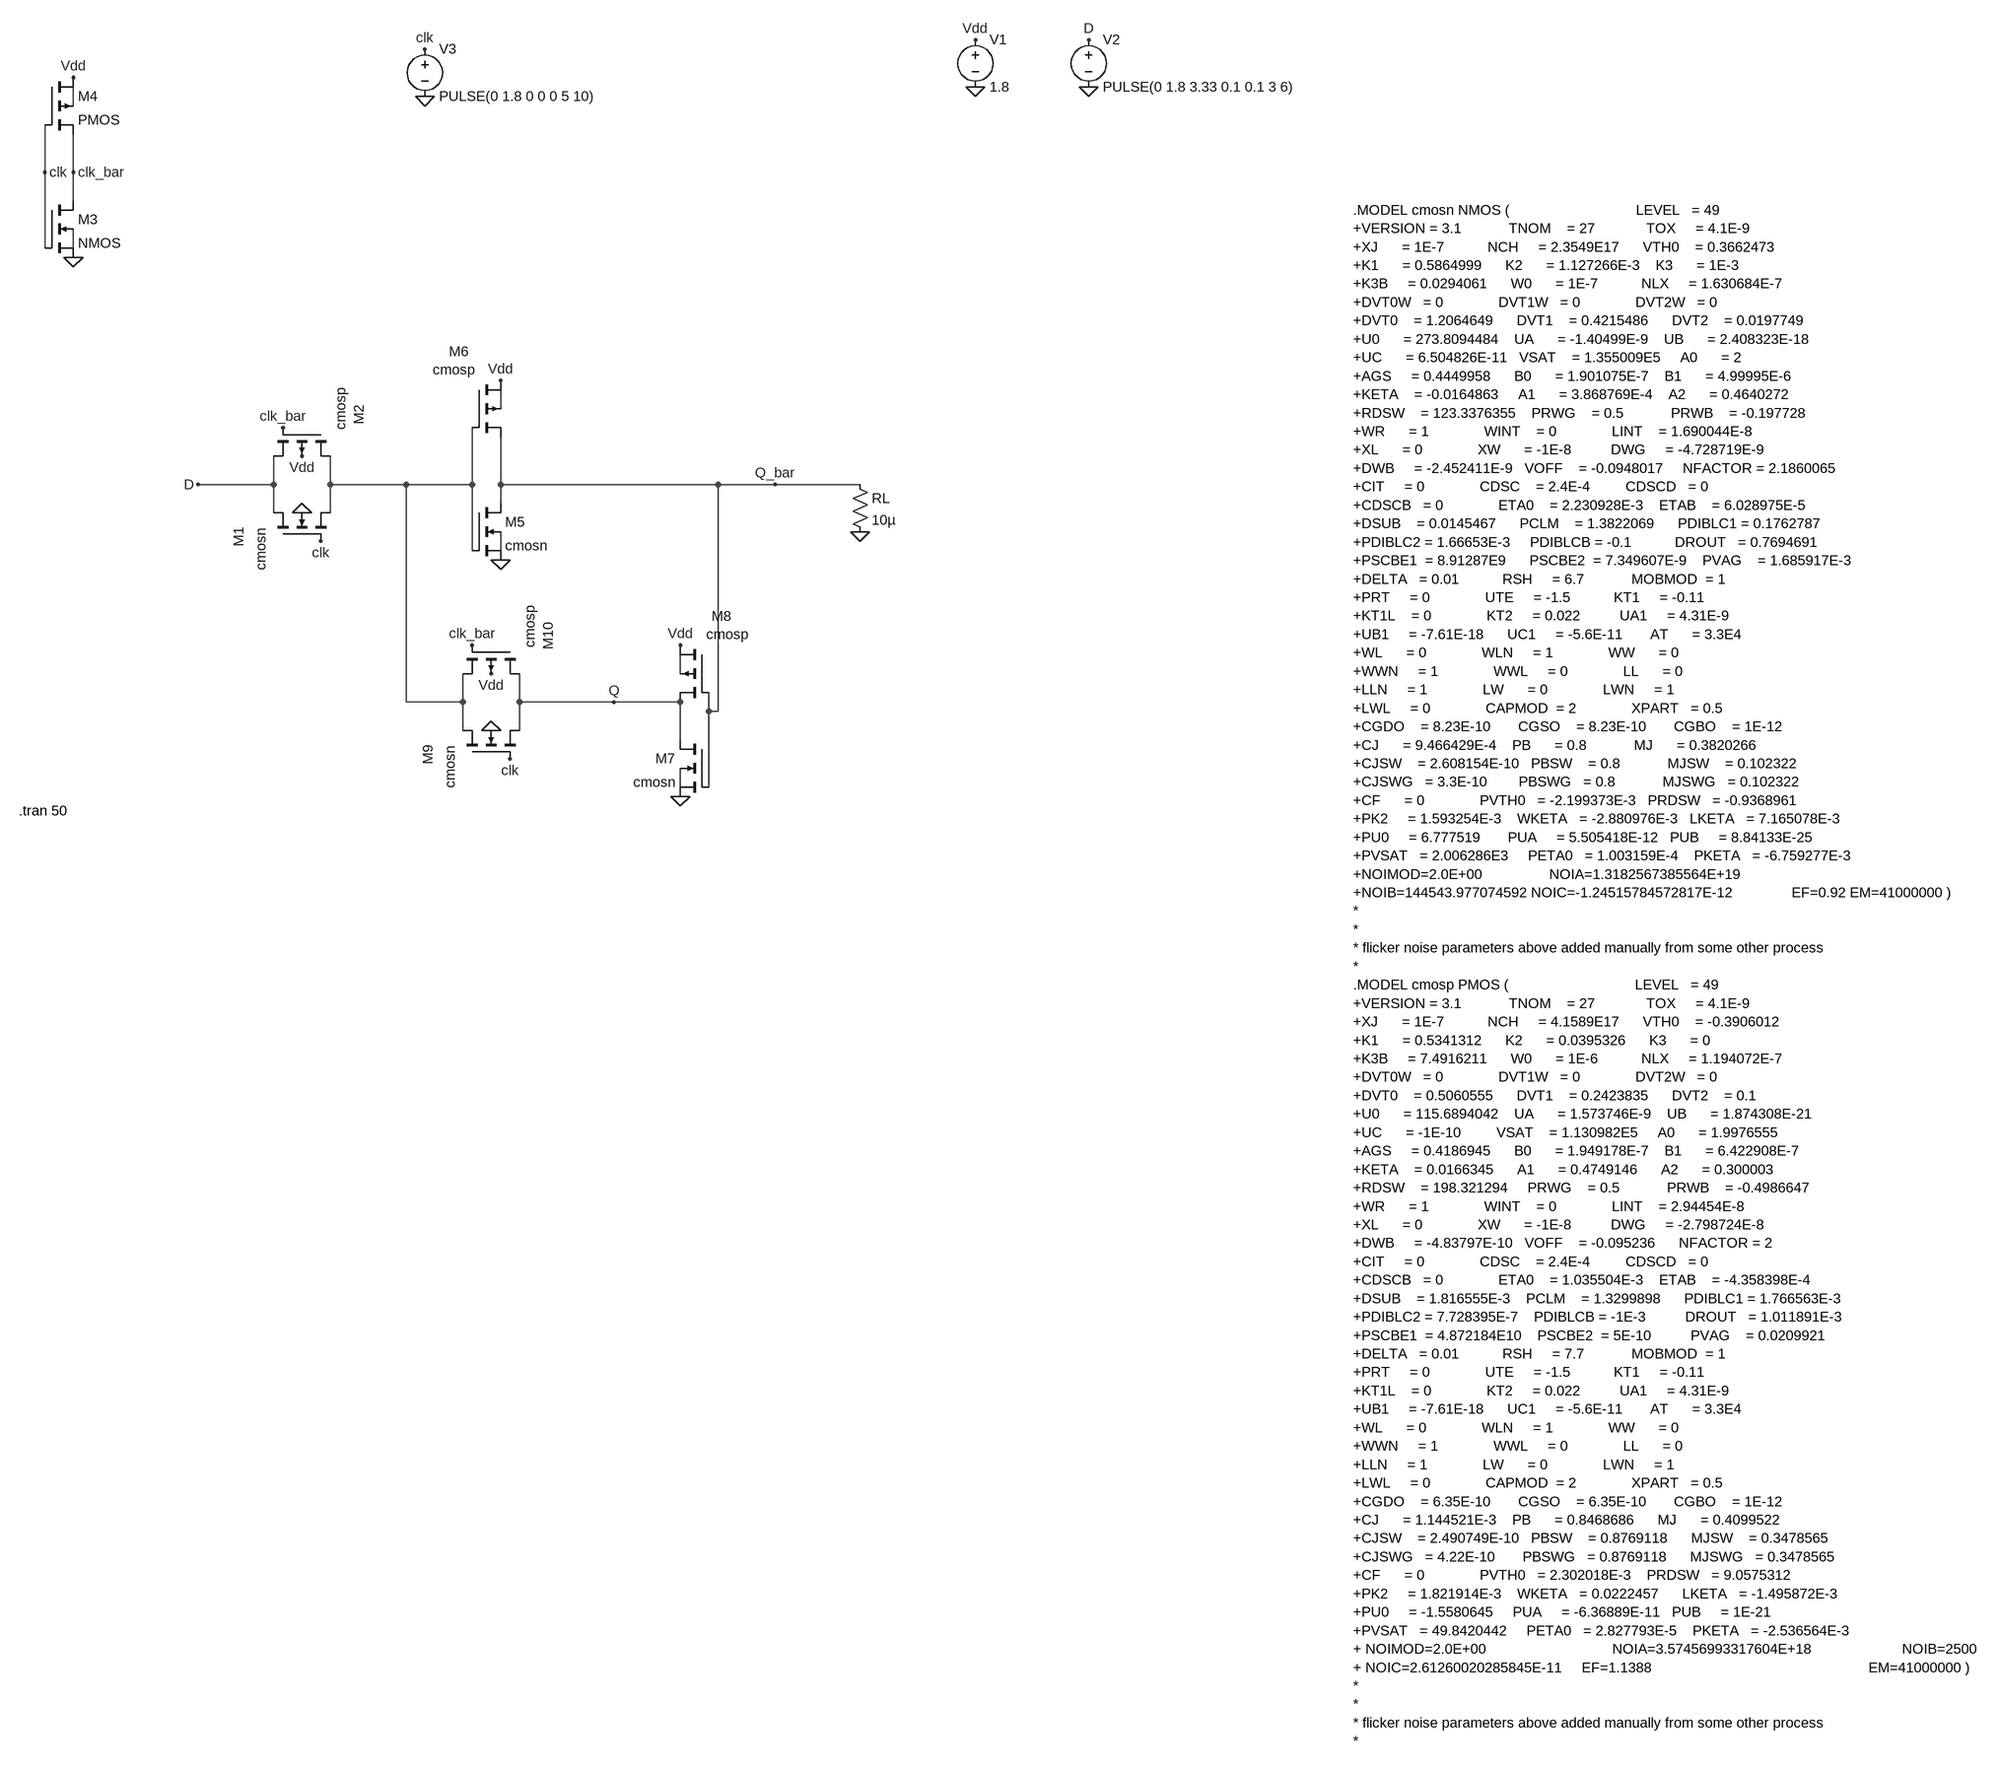
[diagram p0: schematic D_LATCH.asc]
D_LATCH.asc, the LTspice schematic file:
Version 4
SHEET 1 3676 4420
WIRE -2496 -112 -2496 -144
WIRE -2544 0 -2544 -80
WIRE -2496 0 -2496 -64
WIRE -2496 48 -2496 0
WIRE -2544 128 -2544 0
WIRE -2496 128 -2496 96
WIRE -1520 400 -1520 368
WIRE -1904 528 -1904 480
WIRE -1904 528 -2032 528
WIRE -1808 528 -1808 480
WIRE -1680 528 -1808 528
WIRE -1568 528 -1568 432
WIRE -1568 528 -1680 528
WIRE -1520 528 -1520 448
WIRE -1152 528 -1520 528
WIRE -1056 528 -1152 528
WIRE -912 528 -1056 528
WIRE -1520 560 -1520 528
WIRE -1904 576 -1904 528
WIRE -1808 576 -1808 528
WIRE -1568 640 -1568 528
WIRE -1520 640 -1520 608
WIRE -1216 848 -1216 816
WIRE -1680 896 -1680 528
WIRE -1584 896 -1584 848
WIRE -1584 896 -1680 896
WIRE -1488 896 -1488 848
WIRE -1328 896 -1488 896
WIRE -1216 896 -1328 896
WIRE -1168 912 -1168 880
WIRE -1152 912 -1152 528
WIRE -1152 912 -1168 912
WIRE -1584 944 -1584 896
WIRE -1488 944 -1488 896
WIRE -1216 960 -1216 896
WIRE -1216 1040 -1216 1008
WIRE -1168 1040 -1168 912
FLAG -672 -144 0
FLAG -672 -224 Vdd
FLAG -432 -144 0
FLAG -432 -224 D
FLAG -1856 576 0
FLAG -1856 480 Vdd
FLAG -2496 144 0
FLAG -2496 -160 Vdd
FLAG -1648 -128 0
FLAG -1648 -208 clk
FLAG -2544 0 clk
FLAG -2496 0 clk_bar
FLAG -1888 432 clk_bar
FLAG -1824 624 clk
FLAG -2032 528 D
FLAG -1520 656 0
FLAG -1520 352 Vdd
FLAG -1216 1056 0
FLAG -1536 944 0
FLAG -1536 848 Vdd
FLAG -1568 800 clk_bar
FLAG -1504 992 clk
FLAG -1056 528 Q_bar
FLAG -912 608 0
FLAG -1216 800 Vdd
FLAG -1328 896 Q
SYMBOL voltage -672 -240 R0
WINDOW 123 0 0 Left 0
WINDOW 39 0 0 Left 0
SYMATTR InstName V1
SYMATTR Value 1.8
SYMBOL voltage -432 -240 R0
WINDOW 123 0 0 Left 0
WINDOW 39 0 0 Left 0
SYMATTR InstName V2
SYMATTR Value PULSE(0 1.8 3.33 0.1 0.1 3 6)
SYMBOL nmos4 -1904 624 R270
WINDOW 0 -10 -58 Left 2
WINDOW 3 -50 -21 Left 2
SYMATTR InstName M1
SYMATTR Value cmosn
SYMATTR Value2 l=0.18u w=1u
SYMBOL pmos4 -1808 432 R90
WINDOW 0 -39 -49 Left 2
WINDOW 3 -67 -18 Left 2
SYMATTR InstName M2
SYMATTR Value cmosp
SYMATTR Value2 l=0.18u w=1u
SYMBOL nmos4 -2544 48 R0
SYMATTR InstName M3
SYMATTR Value2 l=0.13u w=0.13u
SYMBOL pmos4 -2544 -160 R0
SYMATTR InstName M4
SYMATTR Value2 l=0.13u w=0.13u
SYMBOL voltage -1648 -224 R0
WINDOW 123 0 0 Left 0
WINDOW 39 0 0 Left 0
SYMATTR InstName V3
SYMATTR Value PULSE(0 1.8 0 0 0 5 10)
SYMBOL nmos4 -1568 560 R0
SYMATTR InstName M5
SYMATTR Value2 l=0.13u w=0.13u
SYMATTR Value cmosn
SYMBOL nmos4 -1168 960 M0
SYMATTR InstName M7
SYMATTR Value2 l=0.13u w=0.13u
SYMATTR Value cmosn
SYMBOL nmos4 -1584 992 R270
WINDOW 0 -10 -58 Left 2
WINDOW 3 -50 -21 Left 2
SYMATTR InstName M9
SYMATTR Value cmosn
SYMATTR Value2 l=0.18u w=1u
SYMBOL pmos4 -1488 800 R90
WINDOW 0 -39 -49 Left 2
WINDOW 3 -67 -18 Left 2
SYMATTR InstName M10
SYMATTR Value cmosp
SYMATTR Value2 l=0.18u w=1u
SYMBOL res -928 512 R0
SYMATTR InstName RL
SYMATTR Value 10µ
SYMBOL pmos4 -1568 352 R0
WINDOW 0 -39 -49 Left 2
WINDOW 3 -67 -18 Left 2
SYMATTR InstName M6
SYMATTR Value cmosp
SYMATTR Value2 l=0.18u w=1u
SYMBOL pmos4 -1168 800 M0
WINDOW 0 -39 -49 Left 2
WINDOW 3 -67 -18 Left 2
SYMATTR InstName M8
SYMATTR Value cmosp
SYMATTR Value2 l=0.18u w=1u
TEXT 264 64 Left 2 !.MODEL cmosn NMOS (                                LEVEL   = 49\n+VERSION = 3.1            TNOM    = 27             TOX     = 4.1E-9\n+XJ      = 1E-7           NCH     = 2.3549E17      VTH0    = 0.3662473\n+K1      = 0.5864999      K2      = 1.127266E-3    K3      = 1E-3\n+K3B     = 0.0294061      W0      = 1E-7           NLX     = 1.630684E-7\n+DVT0W   = 0              DVT1W   = 0              DVT2W   = 0\n+DVT0    = 1.2064649      DVT1    = 0.4215486      DVT2    = 0.0197749\n+U0      = 273.8094484    UA      = -1.40499E-9    UB      = 2.408323E-18\n+UC      = 6.504826E-11   VSAT    = 1.355009E5     A0      = 2\n+AGS     = 0.4449958      B0      = 1.901075E-7    B1      = 4.99995E-6\n+KETA    = -0.0164863     A1      = 3.868769E-4    A2      = 0.4640272\n+RDSW    = 123.3376355    PRWG    = 0.5            PRWB    = -0.197728\n+WR      = 1              WINT    = 0              LINT    = 1.690044E-8\n+XL      = 0              XW      = -1E-8          DWG     = -4.728719E-9\n+DWB     = -2.452411E-9   VOFF    = -0.0948017     NFACTOR = 2.1860065\n+CIT     = 0              CDSC    = 2.4E-4         CDSCD   = 0\n+CDSCB   = 0              ETA0    = 2.230928E-3    ETAB    = 6.028975E-5\n+DSUB    = 0.0145467      PCLM    = 1.3822069      PDIBLC1 = 0.1762787\n+PDIBLC2 = 1.66653E-3     PDIBLCB = -0.1           DROUT   = 0.7694691\n+PSCBE1  = 8.91287E9      PSCBE2  = 7.349607E-9    PVAG    = 1.685917E-3\n+DELTA   = 0.01           RSH     = 6.7            MOBMOD  = 1\n+PRT     = 0              UTE     = -1.5           KT1     = -0.11\n+KT1L    = 0              KT2     = 0.022          UA1     = 4.31E-9\n+UB1     = -7.61E-18      UC1     = -5.6E-11       AT      = 3.3E4\n+WL      = 0              WLN     = 1              WW      = 0\n+WWN     = 1              WWL     = 0              LL      = 0\n+LLN     = 1              LW      = 0              LWN     = 1\n+LWL     = 0              CAPMOD  = 2              XPART   = 0.5\n+CGDO    = 8.23E-10       CGSO    = 8.23E-10       CGBO    = 1E-12\n+CJ      = 9.466429E-4    PB      = 0.8            MJ      = 0.3820266\n+CJSW    = 2.608154E-10   PBSW    = 0.8            MJSW    = 0.102322\n+CJSWG   = 3.3E-10        PBSWG   = 0.8            MJSWG   = 0.102322\n+CF      = 0              PVTH0   = -2.199373E-3   PRDSW   = -0.9368961\n+PK2     = 1.593254E-3    WKETA   = -2.880976E-3   LKETA   = 7.165078E-3\n+PU0     = 6.777519       PUA     = 5.505418E-12   PUB     = 8.84133E-25\n+PVSAT   = 2.006286E3     PETA0   = 1.003159E-4    PKETA   = -6.759277E-3\n+NOIMOD=2.0E+00                 NOIA=1.3182567385564E+19\n+NOIB=144543.977074592 NOIC=-1.24515784572817E-12               EF=0.92 EM=41000000 )\n*\n*\n* flicker noise parameters above added manually from some other process\n* \n.MODEL cmosp PMOS (                                LEVEL   = 49\n+VERSION = 3.1            TNOM    = 27             TOX     = 4.1E-9\n+XJ      = 1E-7           NCH     = 4.1589E17      VTH0    = -0.3906012\n+K1      = 0.5341312      K2      = 0.0395326      K3      = 0\n+K3B     = 7.4916211      W0      = 1E-6           NLX     = 1.194072E-7\n+DVT0W   = 0              DVT1W   = 0              DVT2W   = 0\n+DVT0    = 0.5060555      DVT1    = 0.2423835      DVT2    = 0.1\n+U0      = 115.6894042    UA      = 1.573746E-9    UB      = 1.874308E-21\n+UC      = -1E-10         VSAT    = 1.130982E5     A0      = 1.9976555\n+AGS     = 0.4186945      B0      = 1.949178E-7    B1      = 6.422908E-7\n+KETA    = 0.0166345      A1      = 0.4749146      A2      = 0.300003\n+RDSW    = 198.321294     PRWG    = 0.5            PRWB    = -0.4986647\n+WR      = 1              WINT    = 0              LINT    = 2.94454E-8\n+XL      = 0              XW      = -1E-8          DWG     = -2.798724E-8\n+DWB     = -4.83797E-10   VOFF    = -0.095236      NFACTOR = 2\n+CIT     = 0              CDSC    = 2.4E-4         CDSCD   = 0\n+CDSCB   = 0              ETA0    = 1.035504E-3    ETAB    = -4.358398E-4\n+DSUB    = 1.816555E-3    PCLM    = 1.3299898      PDIBLC1 = 1.766563E-3\n+PDIBLC2 = 7.728395E-7    PDIBLCB = -1E-3          DROUT   = 1.011891E-3\n+PSCBE1  = 4.872184E10    PSCBE2  = 5E-10          PVAG    = 0.0209921\n+DELTA   = 0.01           RSH     = 7.7            MOBMOD  = 1\n+PRT     = 0              UTE     = -1.5           KT1     = -0.11\n+KT1L    = 0              KT2     = 0.022          UA1     = 4.31E-9\n+UB1     = -7.61E-18      UC1     = -5.6E-11       AT      = 3.3E4\n+WL      = 0              WLN     = 1              WW      = 0\n+WWN     = 1              WWL     = 0              LL      = 0\n+LLN     = 1              LW      = 0              LWN     = 1\n+LWL     = 0              CAPMOD  = 2              XPART   = 0.5\n+CGDO    = 6.35E-10       CGSO    = 6.35E-10       CGBO    = 1E-12\n+CJ      = 1.144521E-3    PB      = 0.8468686      MJ      = 0.4099522\n+CJSW    = 2.490749E-10   PBSW    = 0.8769118      MJSW    = 0.3478565\n+CJSWG   = 4.22E-10       PBSWG   = 0.8769118      MJSWG   = 0.3478565\n+CF      = 0              PVTH0   = 2.302018E-3    PRDSW   = 9.0575312\n+PK2     = 1.821914E-3    WKETA   = 0.0222457      LKETA   = -1.495872E-3\n+PU0     = -1.5580645     PUA     = -6.36889E-11   PUB     = 1E-21\n+PVSAT   = 49.8420442     PETA0   = 2.827793E-5    PKETA   = -2.536564E-3 \n+ NOIMOD=2.0E+00                                NOIA=3.57456993317604E+18                       NOIB=2500\n+ NOIC=2.61260020285845E-11     EF=1.1388                                                       EM=41000000 )\n*\n*\n* flicker noise parameters above added manually from some other process\n*
TEXT -2588 1080 Left 2 !.tran 50

The netlist it stands for:
* D_LATCH.asc
V1 Vdd 0 1.8
V2 D 0 PULSE(0 1.8 3.33 0.1 0.1 3 6)
M1 D clk N004 0 cmosn l=0.18u w=1u
M2 N004 clk_bar D Vdd cmosp l=0.18u w=1u
M3 clk_bar clk 0 N002 NMOS l=0.13u w=0.13u
M4 Vdd clk clk_bar N001 PMOS l=0.13u w=0.13u
V3 clk 0 PULSE(0 1.8 0 0 0 5 10)
M5 Q_bar N004 0 N005 cmosn l=0.13u w=0.13u
M7 Q Q_bar 0 N007 cmosn l=0.13u w=0.13u
M9 N004 clk Q 0 cmosn l=0.18u w=1u
M10 Q clk_bar N004 Vdd cmosp l=0.18u w=1u
RL Q_bar 0 10µ
M6 Vdd N004 Q_bar N003 cmosp l=0.18u w=1u
M8 Vdd Q_bar Q N006 cmosp l=0.18u w=1u
.model NMOS NMOS
.model PMOS PMOS
.lib standard.mos
.MODEL cmosn NMOS (                                LEVEL   = 49
+VERSION = 3.1            TNOM    = 27             TOX     = 4.1E-9
+XJ      = 1E-7           NCH     = 2.3549E17      VTH0    = 0.3662473
+K1      = 0.5864999      K2      = 1.127266E-3    K3      = 1E-3
+K3B     = 0.0294061      W0      = 1E-7           NLX     = 1.630684E-7
+DVT0W   = 0              DVT1W   = 0              DVT2W   = 0
+DVT0    = 1.2064649      DVT1    = 0.4215486      DVT2    = 0.0197749
+U0      = 273.8094484    UA      = -1.40499E-9    UB      = 2.408323E-18
+UC      = 6.504826E-11   VSAT    = 1.355009E5     A0      = 2
+AGS     = 0.4449958      B0      = 1.901075E-7    B1      = 4.99995E-6
+KETA    = -0.0164863     A1      = 3.868769E-4    A2      = 0.4640272
+RDSW    = 123.3376355    PRWG    = 0.5            PRWB    = -0.197728
+WR      = 1              WINT    = 0              LINT    = 1.690044E-8
+XL      = 0              XW      = -1E-8          DWG     = -4.728719E-9
+DWB     = -2.452411E-9   VOFF    = -0.0948017     NFACTOR = 2.1860065
+CIT     = 0              CDSC    = 2.4E-4         CDSCD   = 0
+CDSCB   = 0              ETA0    = 2.230928E-3    ETAB    = 6.028975E-5
+DSUB    = 0.0145467      PCLM    = 1.3822069      PDIBLC1 = 0.1762787
+PDIBLC2 = 1.66653E-3     PDIBLCB = -0.1           DROUT   = 0.7694691
+PSCBE1  = 8.91287E9      PSCBE2  = 7.349607E-9    PVAG    = 1.685917E-3
+DELTA   = 0.01           RSH     = 6.7            MOBMOD  = 1
+PRT     = 0              UTE     = -1.5           KT1     = -0.11
+KT1L    = 0              KT2     = 0.022          UA1     = 4.31E-9
+UB1     = -7.61E-18      UC1     = -5.6E-11       AT      = 3.3E4
+WL      = 0              WLN     = 1              WW      = 0
+WWN     = 1              WWL     = 0              LL      = 0
+LLN     = 1              LW      = 0              LWN     = 1
+LWL     = 0              CAPMOD  = 2              XPART   = 0.5
+CGDO    = 8.23E-10       CGSO    = 8.23E-10       CGBO    = 1E-12
+CJ      = 9.466429E-4    PB      = 0.8            MJ      = 0.3820266
+CJSW    = 2.608154E-10   PBSW    = 0.8            MJSW    = 0.102322
+CJSWG   = 3.3E-10        PBSWG   = 0.8            MJSWG   = 0.102322
+CF      = 0              PVTH0   = -2.199373E-3   PRDSW   = -0.9368961
+PK2     = 1.593254E-3    WKETA   = -2.880976E-3   LKETA   = 7.165078E-3
+PU0     = 6.777519       PUA     = 5.505418E-12   PUB     = 8.84133E-25
+PVSAT   = 2.006286E3     PETA0   = 1.003159E-4    PKETA   = -6.759277E-3
+NOIMOD=2.0E+00                 NOIA=1.3182567385564E+19
+NOIB=144543.977074592 NOIC=-1.24515784572817E-12               EF=0.92 EM=41000000 )
*
*
* flicker noise parameters above added manually from some other process
*
.MODEL cmosp PMOS (                                LEVEL   = 49
+VERSION = 3.1            TNOM    = 27             TOX     = 4.1E-9
+XJ      = 1E-7           NCH     = 4.1589E17      VTH0    = -0.3906012
+K1      = 0.5341312      K2      = 0.0395326      K3      = 0
+K3B     = 7.4916211      W0      = 1E-6           NLX     = 1.194072E-7
+DVT0W   = 0              DVT1W   = 0              DVT2W   = 0
+DVT0    = 0.5060555      DVT1    = 0.2423835      DVT2    = 0.1
+U0      = 115.6894042    UA      = 1.573746E-9    UB      = 1.874308E-21
+UC      = -1E-10         VSAT    = 1.130982E5     A0      = 1.9976555
+AGS     = 0.4186945      B0      = 1.949178E-7    B1      = 6.422908E-7
+KETA    = 0.0166345      A1      = 0.4749146      A2      = 0.300003
+RDSW    = 198.321294     PRWG    = 0.5            PRWB    = -0.4986647
+WR      = 1              WINT    = 0              LINT    = 2.94454E-8
+XL      = 0              XW      = -1E-8          DWG     = -2.798724E-8
+DWB     = -4.83797E-10   VOFF    = -0.095236      NFACTOR = 2
+CIT     = 0              CDSC    = 2.4E-4         CDSCD   = 0
+CDSCB   = 0              ETA0    = 1.035504E-3    ETAB    = -4.358398E-4
+DSUB    = 1.816555E-3    PCLM    = 1.3299898      PDIBLC1 = 1.766563E-3
+PDIBLC2 = 7.728395E-7    PDIBLCB = -1E-3          DROUT   = 1.011891E-3
+PSCBE1  = 4.872184E10    PSCBE2  = 5E-10          PVAG    = 0.0209921
+DELTA   = 0.01           RSH     = 7.7            MOBMOD  = 1
+PRT     = 0              UTE     = -1.5           KT1     = -0.11
+KT1L    = 0              KT2     = 0.022          UA1     = 4.31E-9
+UB1     = -7.61E-18      UC1     = -5.6E-11       AT      = 3.3E4
+WL      = 0              WLN     = 1              WW      = 0
+WWN     = 1              WWL     = 0              LL      = 0
+LLN     = 1              LW      = 0              LWN     = 1
+LWL     = 0              CAPMOD  = 2              XPART   = 0.5
+CGDO    = 6.35E-10       CGSO    = 6.35E-10       CGBO    = 1E-12
+CJ      = 1.144521E-3    PB      = 0.8468686      MJ      = 0.4099522
+CJSW    = 2.490749E-10   PBSW    = 0.8769118      MJSW    = 0.3478565
+CJSWG   = 4.22E-10       PBSWG   = 0.8769118      MJSWG   = 0.3478565
+CF      = 0              PVTH0   = 2.302018E-3    PRDSW   = 9.0575312
+PK2     = 1.821914E-3    WKETA   = 0.0222457      LKETA   = -1.495872E-3
+PU0     = -1.5580645     PUA     = -6.36889E-11   PUB     = 1E-21
+PVSAT   = 49.8420442     PETA0   = 2.827793E-5    PKETA   = -2.536564E-3
+ NOIMOD=2.0E+00                                NOIA=3.57456993317604E+18                       NOIB=2500
+ NOIC=2.61260020285845E-11     EF=1.1388                                                       EM=41000000 )
*
*
* flicker noise parameters above added manually from some other process
*
.tran 50
.backanno
.end